# Altium schematic sheet dFire.SchDoc
size A3
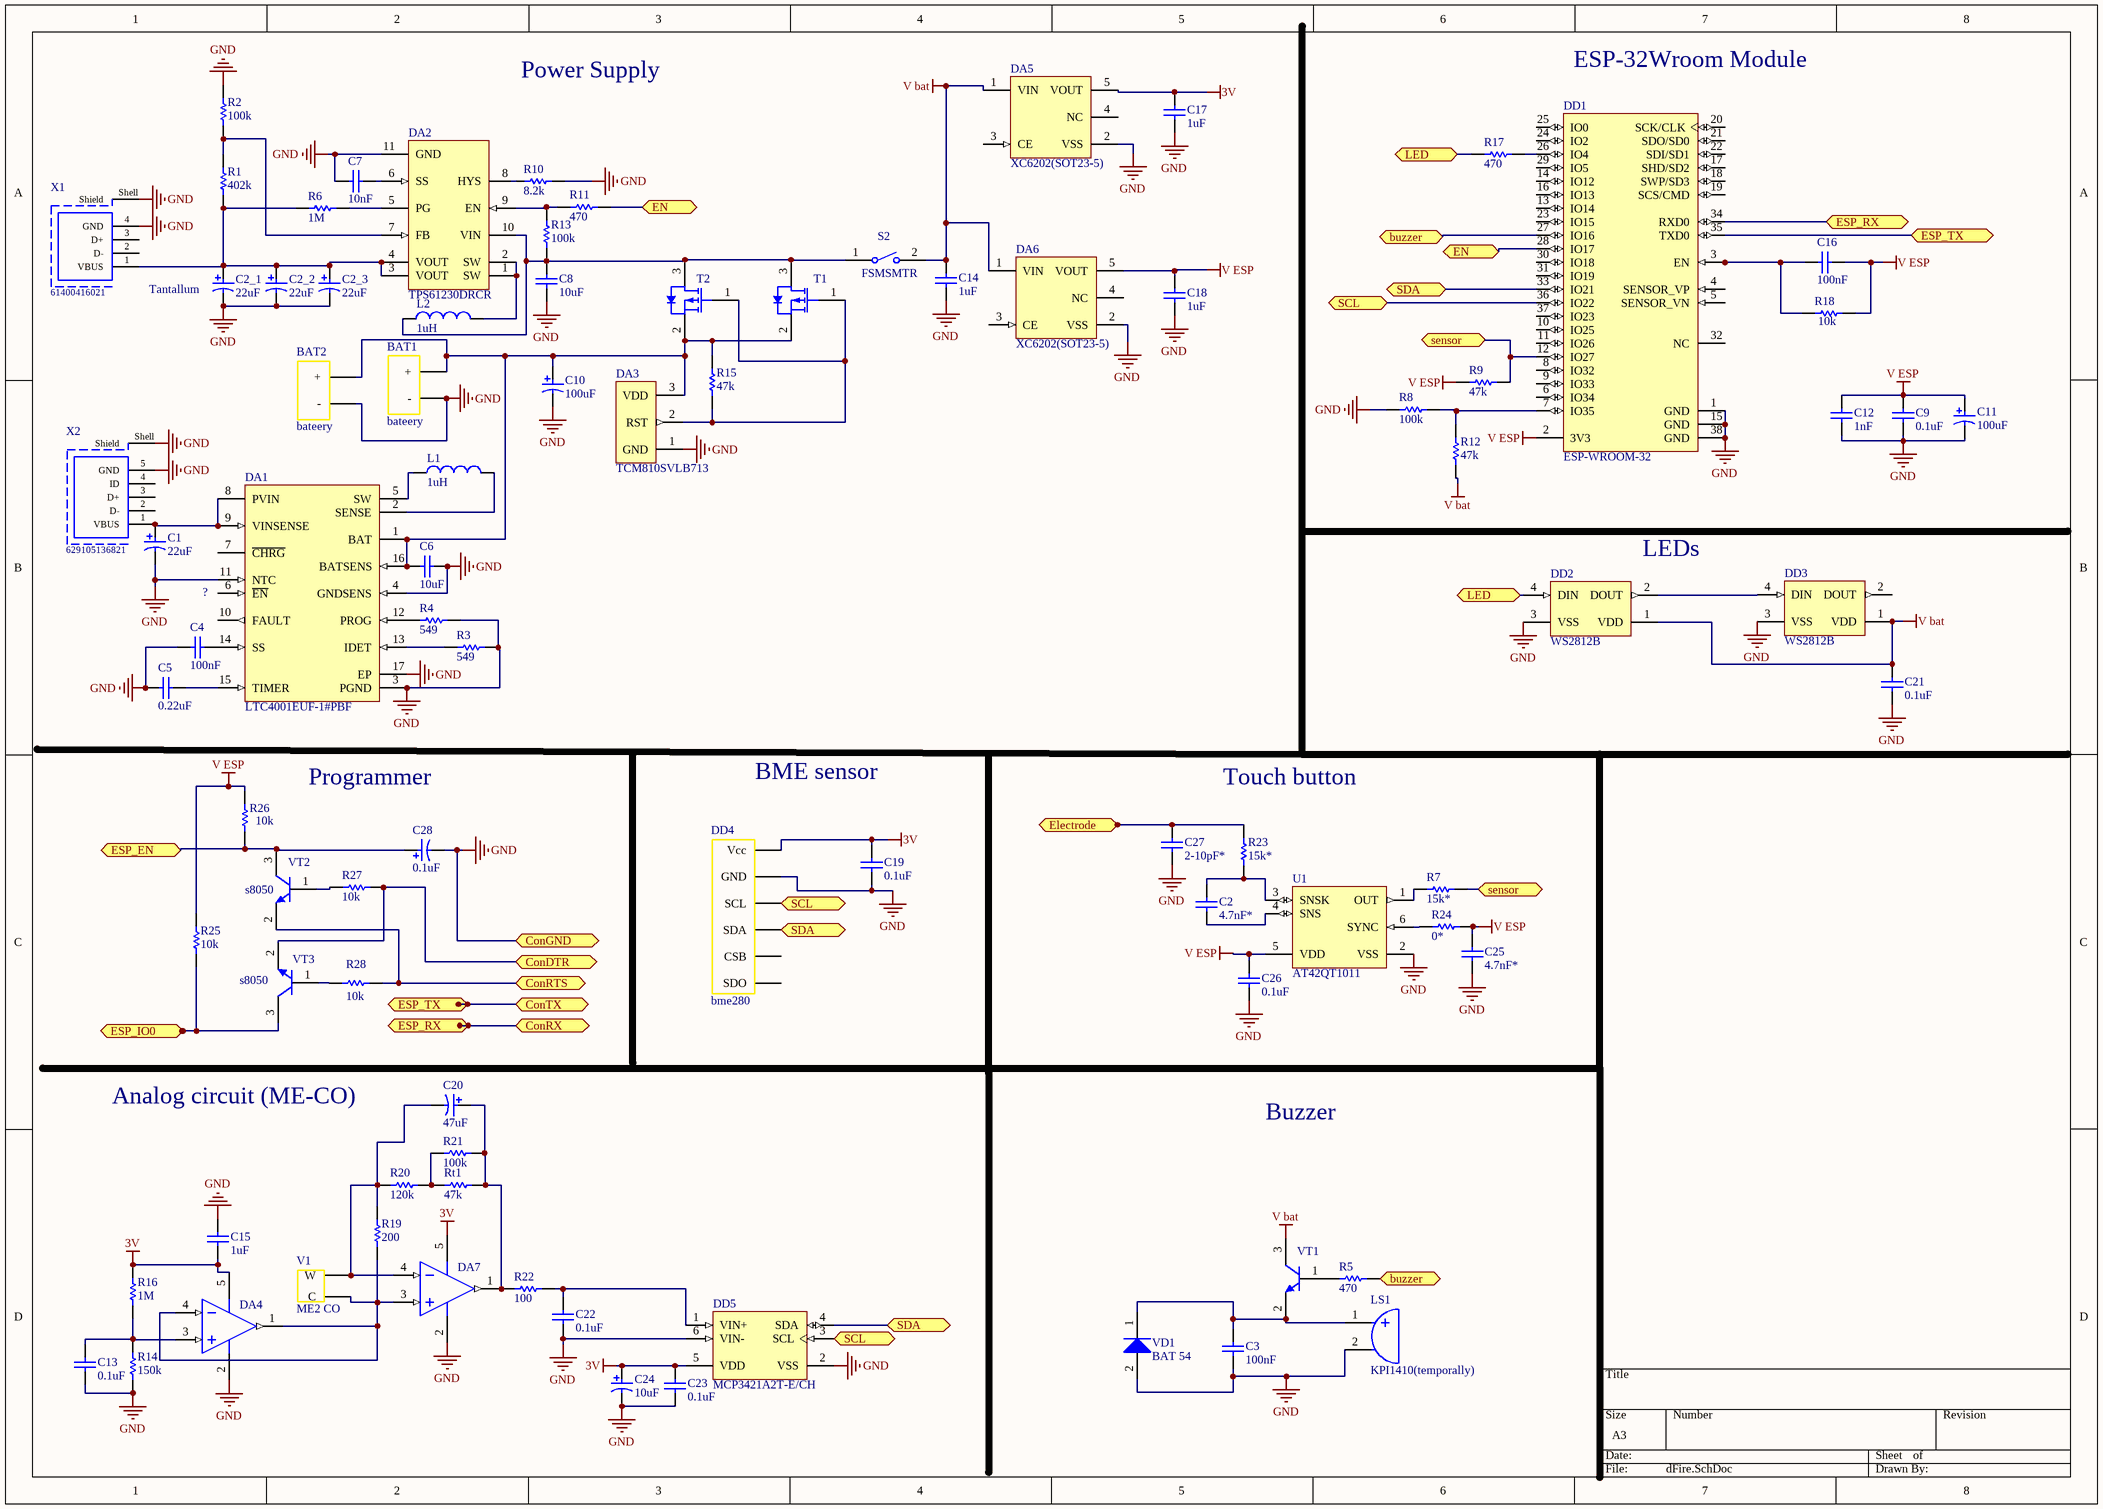
[diagram p0: dFire.SchDoc]

## Parts
BAT1  bateery  [battery]
BAT2  bateery  [battery]
C1  22uF  [KEMT-A-3216-18-2_M]
C2  4.7nF*  [CAPC0805(2012)155_L]
C2_1  22uF  [KEMT-A-3216-18-2_M]
C2_2  22uF  [KEMT-A-3216-18-2_M]
C2_3  22uF  [KEMT-A-3216-18-2_M]
C3  100nF  [CAPC0805(2012)155_L]
C4  100nF  [CAPC0805(2012)155_L]
C5  0.22uF  [CAPC0805(2012)155_L]
C6  10uF  [CAPC0805(2012)155_L]
C7  10nF  [CAPC0805(2012)155_L]
C8  10uF  [CAPC0805(2012)155_L]
C9  0.1uF  [CAPC0805(2012)155_L]
C10  100uF  [KEMT-A-3216-18-2_M]
C11  100uF  [KEMT-A-3216-18-2_M]
C12  1nF  [CAPC0805(2012)155_L]
C13  0.1uF  [CAPC0805(2012)155_L]
C14  1uF  [CAPC0805(2012)155_L]
C15  1uF  [CAPC0805(2012)155_L]
C16  100nF  [CAPC0805(2012)155_L]
C17  1uF  [CAPC0805(2012)155_L]
C18  1uF  [CAPC0805(2012)155_L]
C19  0.1uF  [CAPC0805(2012)155_L]
C20  47uF  [KEMT-A-3216-18-2_M]
C21  0.1uF  [CAPC0805(2012)155_L]
C22  0.1uF  [CAPC0805(2012)155_L]
C23  0.1uF  [CAPC0805(2012)155_L]
C24  10uF  [KEMT-A-3216-18-2_M]
C25  4.7nF*  [CAPC0805(2012)155_L]
C26  0.1uF  [CAPC0805(2012)155_L]
C27  2-10pF*  [CAPC0805(2012)155_L]
C28  0.1uF  [KEMT-A-3216-18-2_M]
DA1  LTC4001EUF-1#PBF  [LT-UF-16_N]
DA2  TPS61230DRCR  [DRC0010G_V]
DA3  TCM810SVLB713  [SC70-LB3_L]
DA4  AD8603AUJ-REEL  [ADI-UJ-5_M]  (value not drawn)
DA5  XC6202(SOT23-5)  [TORX-SOT-25-5_L]
DA6  XC6202(SOT23-5)  [TORX-SOT-25-5_L]
DA7  AD8603AUJ-REEL  [ADI-UJ-5_M]  (value not drawn)
DD1  ESP-WROOM-32  [OLMX-ESP-WROOM-32]
DD2  WS2812B  [ADAI-WS2812B_V]
DD3  WS2812B  [ADAI-WS2812B_V]
DD4  bme280  [BME280]
DD5  MCP3421A2T-E/CH  [SOT-23-CH6_L]
L1  1uH  [COIL-XFL4020_V]
L2  1uH  [COIL-XFL4020_V]
LS1  KPI1410(temporally)  [CZCY-CY-12085G-5042-2_V]
R1  402k  [RESC0805(2012)_M]
R2  100k  [RESC0805(2012)_M]
R3  549  [RESC0805(2012)_M]
R4  549  [RESC0805(2012)_M]
R5  470  [RESC0805(2012)_M]
R6  1M  [RESC0805(2012)_M]
R7  15k*  [RESC0805(2012)_M]
R8  100k  [RESC0805(2012)_M]
R9  47k  [RESC0805(2012)_M]
R10  8.2k  [RESC0805(2012)_M]
R11  470  [RESC0805(2012)_M]
R12  47k  [RESC0805(2012)_M]
R13  100k  [RESC0805(2012)_M]
R14  150k  [RESC0805(2012)_M]
R15  47k  [RESC0805(2012)_M]
R16  1M  [RESC0805(2012)_M]
R17  470  [RESC0805(2012)_M]
R18  10k  [RESC0805(2012)_M]
R19  200  [RESC0805(2012)_M]
R20  120k  [RESC0805(2012)_M]
R21  100k  [RESC0805(2012)_M]
R22  100  [RESC0805(2012)_M]
R23  15k*  [RESC0805(2012)_M]
R24  0*  [RESC0805(2012)_M]
R25  10k  [RESC0805(2012)_M]
R26  10k  [RESC0805(2012)_M]
R27  10k  [RESC0805(2012)_M]
R28  10k  [RESC0805(2012)_M]
Rt1  47k  [RESC0805(2012)_M]
S2  FSMSMTR  [TECO-FSMSMTR_V]
T1  IRLML6401TRPBF  [INTR-SOT-23-3_V]  (value not drawn)
T2  IRLML6401TRPBF  [INTR-SOT-23-3_V]  (value not drawn)
U1  AT42QT1011  [6ST1_N]
V1  ME2 CO  [ME2 CO]
VD1  BAT 54  [INF-SOD323_V]
VT1  (no value)  [ONSC-SOT-23-3-318-08_V]
VT2  s8050  [ONSC-SOT-23-3-318-08_V]
VT3  s8050  [ONSC-SOT-23-3-318-08_V]
X1  61400416021  [61400416021]
X2  629105136821  [629105136821]

## Ports
buzzer, ConDTR (bidir), ConGND (bidir), ConRTS (bidir), ConRX (bidir), ConTX (bidir), Electrode, EN, ESP_EN (bidir), ESP_IO0 (bidir), ESP_RX (bidir), ESP_TX (bidir), LED, SCL, SDA, sensor

## Nets
3V: C15.1 C17.2 C19.2 C23.2 C24.1 DA4.5(+V) DA5.5(VOUT) DA7.5(+V) DD4.1(Vcc) DD5.5(VDD) R16.2
GND: BAT1.2(-) BAT2.2(-) C1.2 C2_1.2 C2_2.2 C2_3.2 C3.2 C4.2 C5.2 C6.1 C7.2 C8.1 C9.1 C10.2 C11.2 C12.1 C13.1 C14.1 C15.2 C17.1 C18.1 C19.1 C21.1 C22.2 C23.1 C24.2 C25.1 C26.1 C27.1 C28.2 DA1.3(PGND) DA1.4(GNDSENS) DA1.11(NTC) DA1.17(EP) DA2.11(GND) DA3.1(GND) DA4.2(-V) DA5.2(VSS) DA6.2(VSS) DA7.2(-V) DD1.1(GND) DD1.15(GND) DD1.38(GND) DD2.3(VSS) DD3.3(VSS) DD4.2(GND) DD5.2(VSS) DD5.6(VIN-) LS1.2(K) R2.2 R3.2 R4.2 R8.1 R10.1 R14.1 U1.2(VSS) VD1.2(A) X1.4(GND) X1.Shell(Shield) X2.5(GND) X2.Shell(Shield) ; port ConGND
V bat: C14.2 C21.2 DA5.1(VIN) DA6.1(VIN) DD2.1(VDD) DD3.1(VDD) R12.2 S2.2 VT1.3(C)
V ESP: C9.2 C11.1 C12.2 C16.1 C18.2 C25.2 C26.2 DA6.5(VOUT) DD1.2(3V3) R9.2 R18.2 R24.2 R25.2 R26.2 U1.5(VDD)
buzzer: DD1.27(IO16) R5.2 ; port buzzer
ConDTR: R27.2 VT3.2(E) ; port ConDTR
ConRTS: R28.2 VT2.2(E) ; port ConRTS
ConRX: DD1.34(RXD0) ; port ConRX, port ESP_RX
ConTX: DD1.35(TXD0) ; port ConTX, port ESP_TX
Electrode: C27.2 R23.2 ; port Electrode
EN: DD1.28(IO17) R11.2 ; port EN
ESP_EN: C28.1 R26.1 VT2.3(C) ; port ESP_EN
ESP_IO0: R25.1 VT3.3(C) ; port ESP_IO0
LED: DD2.4(DIN) R17.1 ; port LED
SCL: DD1.36(IO22) DD4.3(SCL) DD5.3(SCL) ; port SCL
SDA: DD1.33(IO21) DD4.4(SDA) DD5.4(SDA) ; port SDA
sensor: DD1.12(IO27) R7.2 R9.1 ; port sensor
NetBAT1_1: BAT1.1(+) BAT2.1(+) C6.2 C10.1 DA1.1(BAT) DA1.16(BATSENS) DA3.3(VDD) R15.2 T1.2(SOURCE) T2.2(SOURCE)
NetC1_1: C1.1 DA1.8(PVIN) DA1.9(VINSENSE) X2.1(VBUS)
NetC2_1: C2.1 U1.4(SNS)
NetC2_1_1: C2_1.1 C2_2.1 C2_3.1 DA2.3(VOUT) DA2.4(VOUT) R1.1 R6.1 X1.1(VBUS)
NetC2_2: C2.2 R23.1 U1.3(SNSK)
NetC3_1: C3.1 LS1.1(A) VD1.1(K) VT1.2(E)
NetC4_1: C4.1 DA1.14(SS)
NetC5_1: C5.1 DA1.15(TIMER)
NetC7_1: C7.1 DA2.6(SS)
NetC8_2: C8.2 DA2.10(VIN) L2.1 R13.1 S2.1 T1.3(DRAIN) T2.3(DRAIN)
NetC13_2: C13.2 DA4.3(+IN) R14.2 R16.1
NetC16_2: C16.2 DD1.3(EN) R18.1
NetC20_1: C20.1 DA7.1(OUT) R21.2 R22.1 Rt1.2
NetC20_2: C20.2 DA7.4(-IN) R19.2 R20.1 V1.1(W)
NetC22_1: C22.1 DD5.1(VIN+) R22.2
NetDA1_2: DA1.2(SENSE) L1.2
NetDA1_5: DA1.5(SW) L1.1
NetDA1_12: DA1.12(PROG) R4.1
NetDA1_13: DA1.13(IDET) R3.1
NetDA2_1: DA2.1(SW) DA2.2(SW) L2.2
NetDA2_5: DA2.5(PG) R6.2
NetDA2_7: DA2.7(FB) R1.2 R2.1
NetDA2_8: DA2.8(HYS) R10.2
NetDA2_9: DA2.9(EN) R11.1 R13.2
NetDA3_2: DA3.2(RST) R15.1 T1.1(GATE) T2.1(GATE)
NetDA4_1: DA4.1(OUT) DA4.4(-IN) DA7.3(+IN) R19.1 V1.2(C)
NetDD1_7: DD1.7(IO35) R8.2 R12.1
NetDD1_26: DD1.26(IO4) R17.2
NetDD2_2: DD2.2(DOUT) DD3.4(DIN)
NetR5_1: R5.1 VT1.1(B)
NetR7_1: R7.1 U1.1(OUT)
NetR20_2: R20.2 R21.1 Rt1.1
NetR24_1: R24.1 U1.6(SYNC)
NetR27_1: R27.1 VT2.1(B)
NetR28_1: R28.1 VT3.1(B)

Not connected (* = marked no-connect by the designer): DA1 6(~{EN}) 7(~{CHRG}) 10(FAULT); DA5 3(CE) 4(NC); DA6 3(CE) 4(NC); DD1 4(SENSOR_VP) 5(SENSOR_VN) 6(IO34) 8(IO32) 9(IO33) 10(IO25) 11(IO26) 13(IO14) 14(IO12) 16(IO13) 17(SHD/SD2) 18(SWP/SD3) 19(SCS/CMD) 20(SCK/CLK) 21(SDO/SD0) 22(SDI/SD1) 23(IO15) 24(IO2) 25(IO0) 29(IO5) 30(IO18) 31(IO19) 32(NC) 37(IO23); DD3 2(DOUT); DD4 5(CSB) 6(SDO); X1 2(D-) 3(D+); X2 2(D-) 3(D+) 4(ID)

## Notes on the sheet
- Power Supply
- (near DD1) ESP-32Wroom Module
- (near C2_1) Tantallum
- (near DD2) LEDs
- ?
- Programmer
- BME sensor
- Touch button
- Analog circuit (ME-CO)
- Buzzer

## Library data of the parts
C1 C2_1-C2_3 C10 C11 C20 C24 C28 = CMP-2000-05172-1: Manufacturer Size Code: A; Manufacturer: Kemet; Type: Molded; Online Catalog: T491Series; Other Names: 399-3684-2; Voltage - Rated: 10V; Lifetime @ Temp.: 2000Hrs@85degC; Product Training Modules: CapacitorBasics-TypicalUsesforCapacitorsDeratingGuidelinesforSurfaceMountTantalumCapacitors; ESR (Equivalent Series Resistance): 3.8Ohm; Tolerance: ±10%; Capacitance: 10µF; Catalog Drawings: T49x,T5xxSeries_A-side1T49x,T5xxSeries_A,B-side2T49x,T5xxSeries_A,SBottom; Family: TantalumCapacitors; Manufacturer URL: http://www.kemet.com/; Datasheet URL: http://www.farnell.com/datasheets/1824869.pdf; Package Reference: 1206; Packaging: Tape&Reel(TR); Series: T491; Operating Temperature: -55degC~125degC; Mounting Type: SurfaceMount; Height - Seated (Max): 0.071"(1.80mm); Package / Case: 1206(3216Metric); Package Description: 2-Pin Surface Mount Device, Body 3.2 x 1.6 mm; Features: GeneralPurpose; Lead Spacing: -; Size / Dimension: 0.126"Lx0.063"W(3.20mmx1.60mm); Standard Package: 2,000; Datasheet Version: Apr-14; Category: Capacitors
C2 C8 C9 C12-C19 C21-C23 C25-C27 = CMP-1036-04882-1: CAP 4.7uF 10V ±10% 0805 (2012 Metric) Thickness 1.55mm SMD; Case-EIA: 0805; Tolerance: Â±10%; Case-Metric: 2012; Rated Voltage: 10 V; Max Thickness: 1.55 mm; Technology: SMT; Value: 4.7uF
C3-C7 = CMP-1036-04882-1: CAP 4.7uF 10V ±10% 0805 (2012  Thickness 1.55mm SMD; Case-EIA: 0805; Tolerance: Â±10%; Case-Metric: 2012; Rated Voltage: 10 V; Max Thickness: 1.55 mm; Technology: SMT; Value: 4.7uF
DA1 = CMP-0471-00567-1: 2 A Synchronous Buck Li-Ion Charger, 4 to 5.5 V Vin, 16-pin QFN (UF-16), -40 to 85 degC, Pb-Free; Manufacturer: Linear Technology; Vin Max(V): 5.5; Float Voltage: 4.1 V; Charge Termination: Timer; Number of Cells: 1; Vin Min(V): 4; Battery Chemistry: Li-Ion, Li-Polymer; Max Charge Current(A): 2; Type of Charger: Switching; DatasheetVersion: Rev. A; PartNumber: LTC4001EUF-1#PBF; Code_JEDEC: MO-220; ComponentLink3Description: Package Specification; PackageReference: UF-16; Mounting Technology: Surface Mount; RoHS: TRUE; ComponentLink1Description: Manufacturer URL; PackageVersion: Jun-10; ComponentLink3URL: http://cds.linear.com/docs/en/packaging/QFN_16_05-08-1692.pdf; PackageDescription: 16-Pin Plastic QFN, Body 4 x 4 mm, Pitch 0.65 mm; ComponentLink2Description: Datasheet; ComponentLink2URL: http://cds.linear.com/docs/en/datasheet/40011fa.pdf; ComponentLink1URL: http://www.linear.com/
DA2 = CMP-0347-00087-2: Boost Converter with 5 A Switch, 2.3 to 5.5 V Input Voltage, 2.5 to 5.5 V Output Voltage, -40 to 85 degC, 10-Pin SON (DRC), Green (RoHS & no Sb/Br), Tape and Reel; Manufacturer: Texas Instruments; Rating: Catalog; Iq (Typ) (mA): 0.035; Switching Frequency (Max) (kHz): 2000; Regulated Outputs (#): 1; Undervoltage Lockout: Fixed; Switch Current Limit (Typ) (A): 5; ComponentLink1URL: http://www.ti.com/; ComponentLink2URL: http://www.ti.com/lit/ds/symlink/tps61230.pdf; ComponentLink3Description: Package Specification; ComponentLink1Description: Manufacturer URL; ComponentLink3URL: http://www.ti.com/lit/ds/symlink/tps61230.pdf; Mounting Technology: Surface Mount; Temperature Range: -40 to 85 degC; PackageReference: DRC0010G; PartNumber: TPS61230DRCR; ComponentLink2Description: Datasheet; Vin (V): 2.3 to 5.5; PackageDescription: 10-Pin Plastic Small Outline No-Lead, Body 3 x 3 mm, Pitch 0.5 mm; PackageVersion: SLVSAQ2A; Packing: Tape and Reel; Vout (V): 2.5 to 5.5; DatasheetVersion: SLVSAQ2A
DA3 = CMP-0138-00306-1: 3-Pin Microcontroller Reset Monitors, 3-Pin SC-70; PackageDescription: 3-Lead Plastic Small Outline Transistor (LB) [SC70]; PackageReference: SC70-LB3; PackageVersion: revBB, Aug-2009; DatasheetVersion: revD, Mar-2005
DA4 DA7 = CMP-0384-02070-2: Single Channel Single-Supply Operation Operational Amplifier, 400 KHz BW, 100 mV/us SR, Industrial, 5-pin SOT23 (UJ-5), Reel; Manufacturer: Analog Devices; Generic Part Number: AD8603; Iq/Amp: 50uA; Input Bias Current: 200fA; V Span Min: 1.8V; Small Signal Bandwidth: 400KHz; Input Offset Voltage: 12uV; V Span Max: 6V; Amplifiers Per Package: 1; ComponentLink2Description: Datasheet; RevisionNote: Reference Circuit URL fixed; ComponentLink3URL: http:/www.analog.com/static/imported-files/packages/PKG_PDF/TSOT(UJ)/UJ_5.pdf; ComponentLink1URL: http://www.analog.com/en/index.html; Mounting Technology: Surface Mount; ComponentLink1Description: Manufacturer URL; PackageReference: UJ-5; ComponentLink4Description: Reference Circuit; DatasheetVersion: Rev. C; ComponentLink3Description: Package Specification; PartNumber: AD8603AUJ-REEL; PackageVersion: 100708-A; ComponentLink2URL: http://www.analog.com/static/imported-files/data_sheets/AD8603_8607_8609.pdf; PackageDescription: 5-Pin Thin Small Outline Transistor Package, Body 2.9 x 1.6 mm, Pitch 0.95 mm; ComponentLink4URL: http://www.analog.com/en/all-operational-amplifiers-op-amps/operational-amplifiers-op-amps/ad8603/products/product.html#product-recommendations; Code_JEDEC: MO-193-AB; Slew Rate: 100mV/us
DA5 DA6 = CMP-0659-00001-1: High Speed LDO Regulator, 700 mA, 1.7 to 6.0 V, -40 to 85 degC, SOT-25 (MR-G), RoHS, Tape and Reel; Manufacturer: Torex; PartNumber: XC6222B331MR-G; Low Power Consumption: 100 uA; Output Voltage: 0.8 to 5 V (0.05 V increments); Accuracy: +/- 1% (Vout>2.0 V) +/- 0.02 V (Vout<=2.0 V); Dropout Voltage: 120 mV @Iout=300 mA (Vout=3.0 V); Out Current (Max): 700 mA; Operating Voltage Range: 1.7 to 6 V; ComponentLink2Description: Datasheet; ComponentLink1Description: Manufacturer URL; PackageDescription: 5-Pin Small Out-Line Transistor, Body 2.9 x 1.6 mm, Pitch 0.95 mm; Mounting Technology: Surface Mount; DatasheetVersion: Dec-13; ComponentLink1URL: http://www.torex.co.jp/; Operating Ambient Temperature: -40 to 85 degC; ComponentLink2URL: http://www.torex.co.jp/english/products/voltage_regulators/data/XC6222.pdf; Packing: Tape and Reel; PackageReference: MR-G-5; RoHS: TRUE
DD1 = CMP-2000-07454-1: Espressif System, 2.7 to 3.6 V, -40 to 85 degC, 38-Pin SMD; Manufacturer: Olimex; Package Description: 38-Pin Surface Mount Device, Body 18 x 25.5 mm, Pitch 1.27 mm; Manufacturer URL: https://www.olimex.com; RoHSCompliant: false; Mounting Technology: SurfaceMount; Datasheet Version: Rev. 2.1, 09/2017; Datasheet URL: http://www.espressif.com/sites/default/files/documentation/esp-wroom-32_datasheet_en.pdf; Package Reference: ESP-WROOM-32
DD2 DD3 = CMP-1740-00005-1: Intelligent Control LED Integrated Light Source, 3.5 to 5.3 V, -25 to 80 degC, 4-Pin SMD, RoHS, Bulk; Case\Package: Radial; Shielding: Unshielded; Current Rating: 240 mA; Tolerance: 10%; Mount: Through Hole; Max Operating Temperature: 125 degC; Radiation Hardening: No; Length: 12.2 mm; Min Operating Temperature: -55 degC; ComponentLink1URL: https://www.adafruit.com/; Packaging: Bulk; Lead Pitch: 5 mm; RoHSCompliant: true; Pins: 2; Package Quantity: 200; ComponentLink2URL: https://cdn-shop.adafruit.com/datasheets/WS2812B.pdf; ComponentLink2Description: Datasheet; PackageDescription: 4-Pin Surface Mount Device, Body 5 x 5 mm, Pitch 3.3 mm; PackageReference: WS2812B; Height: 12.2 mm; REACH SVHC: No SVHC; ComponentLink1Description: Manufacturer URL; DatasheetVersion: May-13
DD5 = CMP-0188-00097-2: 18-Bit Analog-to-Digital Converter with I2C Interface and On-Board Reference, 6-Pin SOT-23, Extended Temperature, Tape and Reel; ComponentLink3URL: http://www.microchip.com/stellent/groups/techpub_sg/documents/packagingspec/en012702.pdf; DatasheetVersion: revE, Aug-2009; Code_IPC: SOT26A-6; RevisionNote: URLs added.; ComponentLink2URL: http://ww1.microchip.com/downloads/en/DeviceDoc/22003e.pdf; ComponentLink1URL: http://www.microchip.com/; ComponentLink3Description: Package Specification; ComponentLink2Description: Datasheet; PackageReference: SOT-23-CH6; PackageDescription: 6-Lead Plastic Small Outline Transistor (CH) [SOT-23]; PackageVersion: revBB, Aug-2009; ComponentLink1Description: Manufacturer URL
L1 L2 = CMP-2000-07423-1: Manufacturer: Coilcraft; Case Width: 4.3mm; Case Height: 2.1mm; Maximum DC Current: 11A; Core Material: Composite; Test Frequency: 100kHz; Tolerance: 20%; Maximum DC Resistance: 11.9mOhms; Shielding: Shielded; Self Resonant Frequency: 64MHz; RoHS: Details; Series: XFL4020; Case Length: 4.3mm; Package Reference: XFL4020; Dimensions: 4.3mmWx4.3mmLx2.1mmH; Product: PowerInductors; Datasheet Version: 07/2012; Manufacturer URL: http://www.coilcraft.com/; Termination Style: SMD/SMT; Mounting Technology: SurfaceMount; Operating Temperature Range: -40Cto+125C; Package Description: 2-Pin Surface Mount Device, Body 4 x 4 mm, Pitch 2.37 mm; Inductance: 1uH; Packaging: Reel; Datasheet URL: http://www.mouser.com/ds/2/597/xfl4020-270756.pdf
LS1 = CMP-1019-00001-1: Buzzer, 5 V, 42 Ohm, -20 to 70 degC, 2-Pin THD, Dia 12 mm, Height 8.5 mm, RoHS, Tray; PartNumber: cy-12085G-5042; Manufacturer: Changzhou Chaoyin; Oscillation Frequency: 2.048 KHz; Rated Voltage: 5 V; Current Consumption (Max.): 35 mA; Resistance Value: 42 +/- 4 Ohm; Sound Pressure Level (Min.): 85 dB; PackageReference: CY-12085G-5042; Mounting Technology: Through Hole; Packing: Tray; RoHS: TRUE; Operating Temperature Range: -20 to 70 degC; PackageDescription: 2-Pin Through-hole Buzzer, Dia 12 mm, Height 8.5 mm
R1-R28 Rt1 = CMP-1013-00017-1: Value: 4.30 Ohm; Tolerance: 5 %; Power: 0.125 W; Case-Metric: 2012; Case-EIA: 0805; Technology: SMT
S2 = CMP-2000-07501-1: FSMSM Push Button Switch, 50 mA, -35 to 85 degC, 2-Pin SMD, RoHS, Tape and Reel; Manufacturer: TE Connectivity; Voltage Rating (DC): 24V; Electrical Life: 20000Cycles; Operating Force: 180gf; Switch Travel: 0.25mm; Contact Current Rating: 50mA; Case\/Package: SMD/SMT; Actuator Length: 1.07mm; Throw Configuration: SPST; Actuator Material: Polyamide; Contact Resistance: 100mOhm; Illumination Type: Illuminated; Max Voltage Rating (DC): 12V; Manufacturer URL: http://www.te.com/; Lead Free: LeadFree; Packaging: TapeandReel; Min Operating Temperature: -35degC; Mechanical Life: 20000Cycles; Mount: SurfaceMount; REACH SVHC: Unknown; Package Quantity: 1800; Package Reference: FSMSMTR; RoHSCompliant: true; Max Operating Temperature: 85degC; Orientation: Straight; ELV: Compliant; Datasheet URL: http://www.te.com/commerce/DocumentDelivery/DDEController?Action=showdoc&DocId=Customer+Drawing%7F1437566-3%7FC2%7Fpdf%7FEnglish%7FENG_CD_1437566-3_C2_1437566_3_1_c.dwg.pdf%7F1437566-4; Package Description: 2-Pin Surface Mount Device, Body 6 x 3.5 mm, Pitch 9.19 mm; Current Rating: 50mA; Contact Plating: Silver; Termination: GullWing; Datasheet Version: Rev. C2, 08/2014; Contact Material: Brass; Mounting Technology: SurfaceMount
T1 T2 = CMP-2000-04986-1: HEXFET(R) Power P-Channel MOSFET, -12 V, -4.3 A, -55 to 150 degC, 3-Pin SOT-23, RoHS, Tape and Reel; Manufacturer: International Rectifier; Maximum Drain Source Voltage: -12V; Maximum Gate Source Voltage: ±8V; Maximum Power Dissipation: 1.3W; Channel Mode: Enhancement; Typical Input Capacitance @ Vds: 830pF@-10V; Channel Type: P; Maximum Drain Source Resistance: 0.085Ω; Typical TurnOff Delay Time: 32ns; Forward Transconductance: 8.6S; Typical Turn On Delay Time: 11ns; Typical Gate Charge @ Vgs: 10nC@-5V; Number of Elements per Chip: 1; Forward Diode Voltage: -1.2V; Configuration: Single; Maximum Continuous Drain Current: -3.4A; Package Reference: SOT-23-3; Package Type: Micro3; Pin Count: 3; Series: HEXFETSeries; Maximum Operating Temperature: +150degC; Length: 3.04mm; Manufacturer URL: http://internationalrectifier.com/; Width: 1.4mm; Category: PowerMOSFET; Dimensions: 3.04x1.40x1.02mm; Minimum Operating Temperature: -55degC; Height: 1.02mm; Datasheet Version: May-10; Mounting Type: SurfaceMount; Datasheet URL: http://datasheet.octopart.com/IRLML6401TRPBF-International-Rectifier-datasheet-10898914.pdf; Package Description: 3-Pin Small Outline Transistor, Body 2.92 x 1.3 mm, Pitch 0.95 mm; Operating Temperature Range: -55to+150degC
U1 = CMP-0073-00014-1: One-channel Touch Sensor IC with no Reset Timer, 6-pin SOT23; DatasheetVersion: revES, Feb-2010; PackageVersion: revA, Jun-2008; Code_IPC: SOT26A-6; PackageDescription: 6-Lead, 2.90 x 1.60 mm Plastic Small Outline Package (SOT23); PackageReference: 6ST1; Code_JEDEC: MO-178-AB
VD1 = CMP-1182-00006-1: Silicon Schottky Diode, SOD323, Reel, Green; Manufacturer: Infineon; PartNumber: BAT 54-03W E6327; Green: TRUE; ComponentLink1Description: Manufacturer URL; ComponentLink1URL: http://www.infineon.com/; PackageReference: SOD323; Packing: Reel; PackageDescription: 2-Pin Small Outline Diode Package, 1.25 x 1.7 mm Body; ComponentLink2Description: Datasheet; Mounting Technology: Surface Mount; ComponentLink3URL: http://www.infineon.com/dgdl/SOD323-Package_Overview.pdf?folderId=db3a30431936bc4b011952aab84f3bbe&fileId=db3a30431936bc4b011952beed653be3; ComponentLink3Description: Package Specification; ComponentLink2URL: http://www.infineon.com/dgdl/bat54series.pdf?folderId=db3a30431400ef68011425f1ca2505e3&fileId=db3a304314dca3890115190b74210ea6; RevisionNote: Lost Devices pt2
VT1-VT3 = CMP-1048-00737-1: General Purpose Transistor, NPN Silicon, 3-Pin SOT-23, Pb-Free, Tape and Reel; Manufacturer: On Semiconductor; PartNumber: BC817-25LT1G; IC Continuous (A): 0.5; fT Min (MHz): 100; PackageDescription: 3-Pin Small Outline Transistor, Body 2.92 x 1.3 mm, Pitch 0.95 mm; ComponentLink3Description: Package Specification; ComponentLink2Description: Datasheet; RoHS: TRUE; PackageVersion: Rev. AP, 11/2009; ComponentLink1URL: http://www.onsemi.com/; PackageReference: SOT-23-3-318-08; ComponentLink3URL: http://www.onsemi.cn/pub_link/Collateral/318-08.PDF; ComponentLink2URL: http://www.onsemi.com/pub_link/Collateral/BC817-16LT1-D.PDF; Mounting Technology: Surface Mount; Packing: Tape and Reel; DatasheetVersion: Rev. 12; Polarity: NPN; ComponentLink1Description: Manufacturer URL
X1 = CMP-1502-03227-1: USB 2.0 Type A Receptacle WR-COM, Horizontal, THT; Manufacturer: Wurth Elektronik; Working Voltage: 30VAC; Rated Current: 1.5A; Contact Resistance: 20mOhm; Manufacturer URL: http://www.we-online.de; Publisher: WurthElektronik; Packaging: Tray; Operating Temperature: -40to105degC; Orientation: Horizontal; Mounting Technology: THT; Part Number: 61400416021; Gender: Receptacle; Package Reference: 61400416021; Connector Type: USB2.0TypeA; Datasheet URL: https://katalog.we-online.de/em/datasheet/61400416021.pdf
X2 = CMP-1502-03253-1: Micro USB 2.0 Type B Receptacle WR-COM, Horizontal, SMT, with Pads and Pegs; Manufacturer: Wurth Elektronik; Contact Resistance: 30mOhm; Rated Current: 1A; Working Voltage: 30VAC; Datasheet URL: https://katalog.we-online.de/em/datasheet/629105136821.pdf; Mounting Technology: SMT; Publisher: WurthElektronik; Package Reference: 629105136821; Orientation: Horizontal; Packaging: TapeandReel; Part Number: 629105136821; Manufacturer URL: http://www.we-online.de; Connector Type: MicroUSB2.0TypeB; Gender: Receptacle; Operating Temperature: -40to105degC